# EAGLE design RoboSkinRev1 (EAGLE 9.4.2)
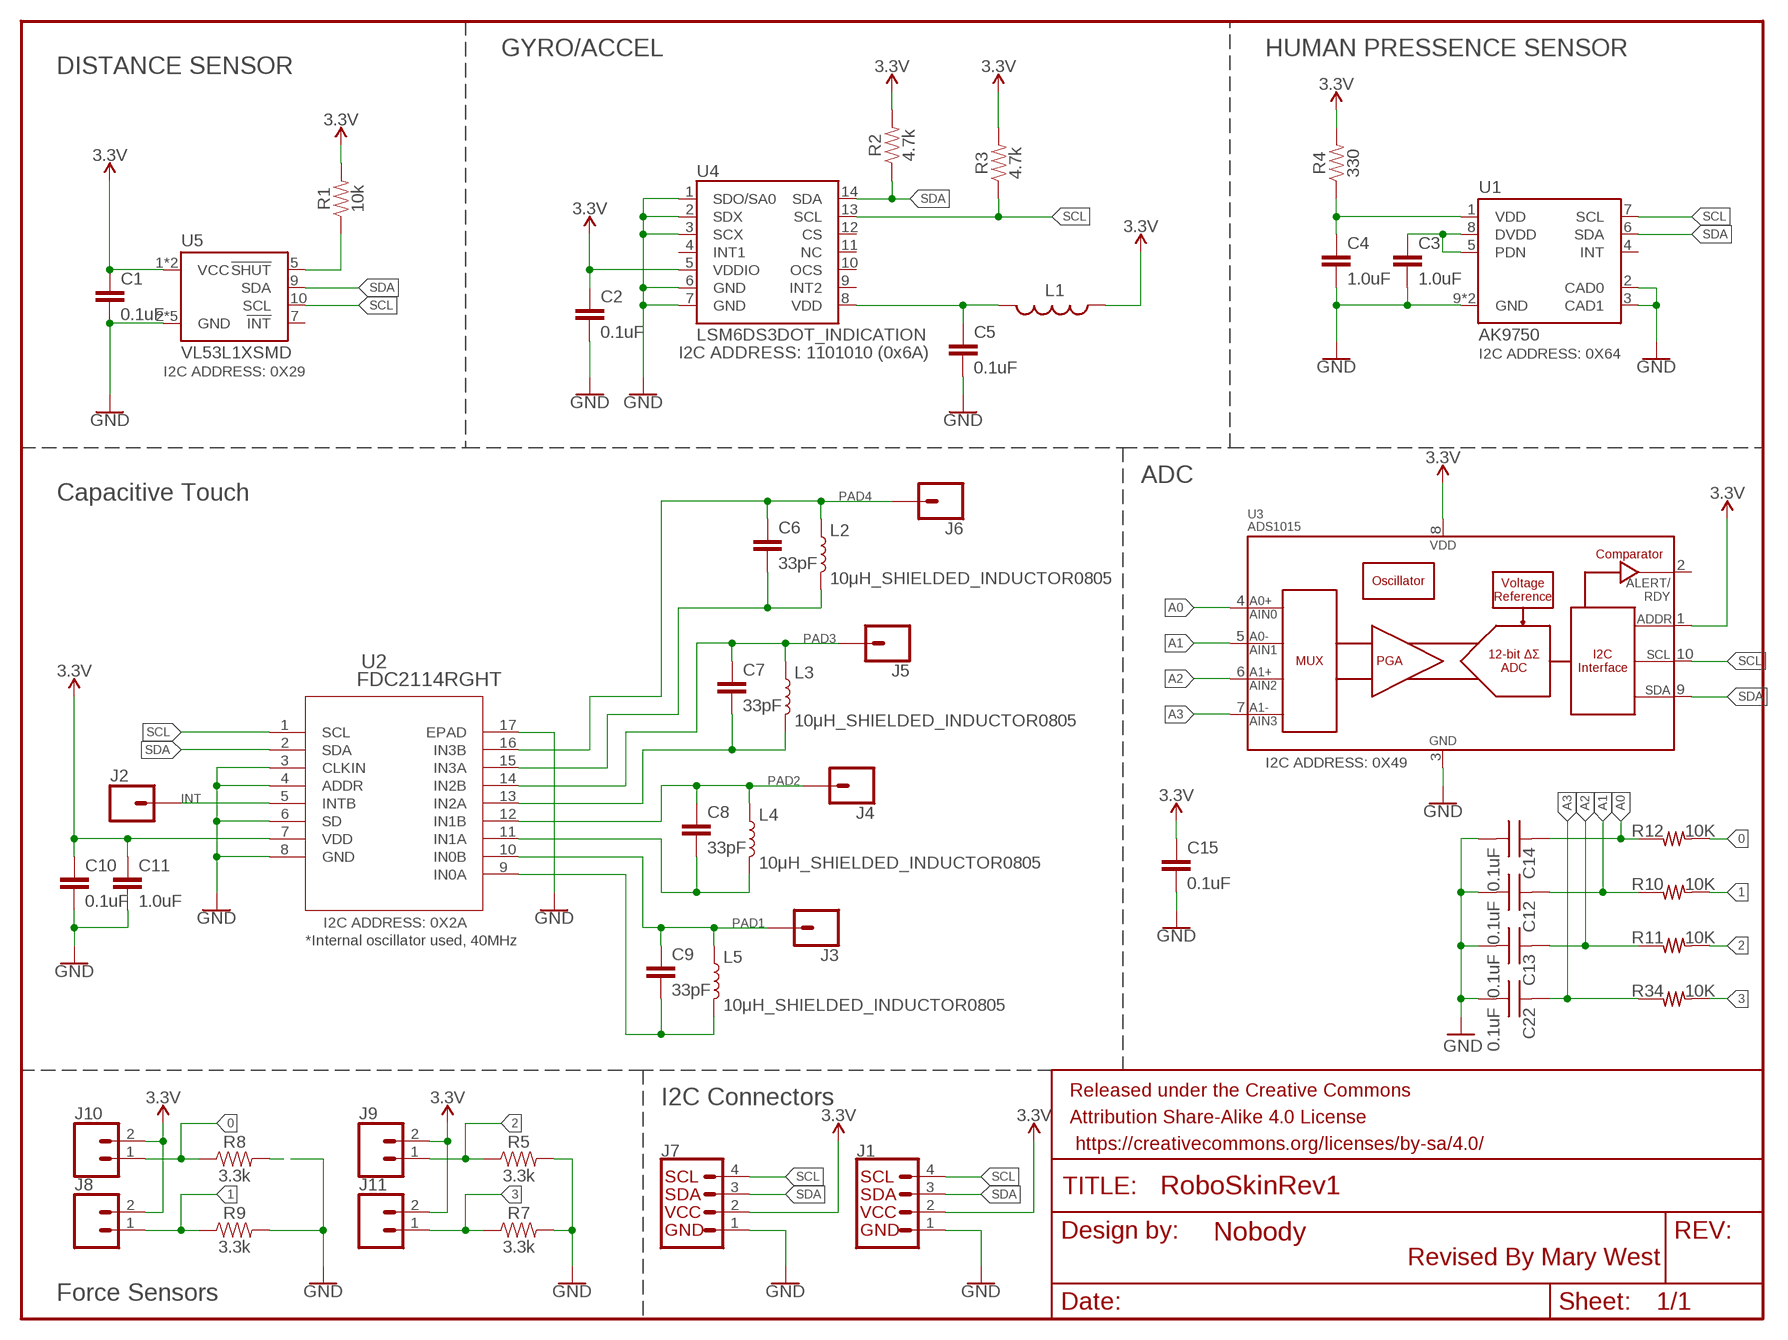
[diagram p0: schematic, sheet 1]

## Parts
C1  0.1uF  0.1UF-0603-25V-(+80/-20%)  [0603]
C2  0.1uF  0.1UF-0603-25V-(+80/-20%)  [0603]
C3  1.0uF  1.0UF-0603-16V-10%  [0603]
C4  1.0uF  1.0UF-0603-16V-10%  [0603]
C5  0.1uF  0.1UF-0603-25V-(+80/-20%)  [0603]
C6  33pF  33PF-0603-50V-5%  [0603]
C7  33pF  33PF-0603-50V-5%  [0603]
C8  33pF  33PF-0603-50V-5%  [0603]
C9  33pF  33PF-0603-50V-5%  [0603]
C10  0.1uF  0.1UF-0603-25V-(+80/-20%)  [0603]
C11  1.0uF  1.0UF-0603-16V-10%  [0603]
C12  0.1uF  CAPACITORC_0603_SILK  [0603_SILK]
C13  0.1uF  CAPACITORC_0603_SILK  [0603_SILK]
C14  0.1uF  CAPACITORC_0603_SILK  [0603_SILK]
C15  0.1uF  0.1UF-0603-25V-(+80/-20%)  [0603]
C22  0.1uF  CAPACITORC_0603_SILK  [0603_SILK]
FRAME1  FRAME-LETTERNO_PACKAGE  [DUMMY]
J1  QWIIC_CONNECTORJS-1MM  [1X04_1MM_RA]
J2  CONN_01  [1X01]
J3  CONN_01  [1X01]
J4  CONN_01  [1X01]
J5  CONN_01  [1X01]
J6  CONN_01  [1X01]
J7  QWIIC_CONNECTORJS-1MM  [1X04_1MM_RA]
J8  CONN_02  [1X02]
J9  CONN_02  [1X02]
J10  CONN_02  [1X02]
J11  CONN_02  [1X02]
L1  RES-07859  INDUCTOR30OHM,1.8A  [0603]
L2  10μH_SHIELDED_INDUCTOR0805  [0805]
L3  10μH_SHIELDED_INDUCTOR0805  [0805]
L4  10μH_SHIELDED_INDUCTOR0805  [0805]
L5  10μH_SHIELDED_INDUCTOR0805  [0805]
R1  10k  10KOHM-0603-1/10W-1%  [0603]
R2  4.7k  4.7KOHM-0603-1/10W-1%  [0603]
R3  4.7k  4.7KOHM-0603-1/10W-1%  [0603]
R4  330  330OHM-0603-1/10W-1%  [0603]
R5  3.3k  3.3KOHM-0603-1/10W-1%  [0603]
R7  3.3k  3.3KOHM-0603-1/10W-1%  [0603]
R8  3.3k  3.3KOHM-0603-1/10W-1%  [0603]
R9  3.3k  3.3KOHM-0603-1/10W-1%  [0603]
R10  10K  RESISTORR_0603_SILK  [0603_SILK]
R11  10K  RESISTORR_0603_SILK  [0603_SILK]
R12  10K  RESISTORR_0603_SILK  [0603_SILK]
R34  10K  RESISTORR_0603_SILK  [0603_SILK]
U1  AK9750  [SON10]
U2  FDC2114RGHT  [RGH16]
U3  ADS1015  [MSOP10]
U4  LSM6DS3DOT_INDICATION  [LGA14L_DOT_INDICATOR]
U5  VL53L1XSMD  [VL53L1X]

## Nets
0: J10.1 R8.1 R12.P2
1: J8.1 R9.1 R10.P2
2: J9.1 R5.1 R11.P2
3: J11.1 R7.1 R34.P2
3.3V: C1.1 C2.1 C10.1 C11.1 C15.1 J1.2(VCC) J7.2(VCC) J8.2 J9.2 J10.2 J11.2 L1.1 R1.2 R2.2 R3.2 R4.2 U2.7(VDD) U3.1(ADDR) U3.8(VDD) U4.5(VDDIO) U5.1(VCC) U5.11(VCC)
A0: C14.P1 R12.P1 U3.4(AIN0)
A1: C12.P1 R10.P1 U3.5(AIN1)
A2: C13.P1 R11.P1 U3.6(AIN2)
A3: C22.P1 R34.P1 U3.7(AIN3)
GND: C1.2 C2.2 C3.2 C4.2 C5.2 C10.2 C11.2 C12.P2 C13.P2 C14.P2 C15.2 C22.P2 J1.1(GND) J7.1(GND) R5.2 R7.2 R8.2 R9.2 U1.2(CAD0) U1.3(CAD1) U1.9(GND) U1.10(GND) U2.3(CLKIN) U2.4(ADDR) U2.6(SD) U2.8(GND) U2.17(EPAD) U3.3(VSS) U4.1(SDO/SA0) U4.2(SDX) U4.3(SCX) U4.6(GND) U4.7(GND) U5.2(GND) U5.3(GND) U5.4(GND) U5.6(GND) U5.12(GND)
INT: J2.1 U2.5(INTB)
N$1: C4.1 R4.1 U1.1(VDD)
N$2: C3.1 U1.5(PDN) U1.8(DVDD)
N$3: R1.1 U5.5(!SHUT)
N$6: C5.1 L1.2 U4.8(VDD)
N$8: C6.2 L2.2 U2.15(IN3A)
N$10: C7.2 L3.2 U2.13(IN2A)
N$12: C8.2 L4.2 U2.11(IN1A)
N$14: C9.2 L5.2 U2.9(IN0A)
PAD1: C9.1 J3.1 L5.1 U2.10(IN0B)
PAD2: C8.1 J4.1 L4.1 U2.12(IN1B)
PAD3: C7.1 J5.1 L3.1 U2.14(IN2B)
PAD4: C6.1 J6.1 L2.1 U2.16(IN3B)
SCL: J1.4(SCL) J7.4(SCL) R3.1 U1.7(SCL) U2.1(SCL) U3.10(SCL) U4.13(SCL) U5.10(SCL)
SDA: J1.3(SDA) J7.3(SDA) R2.1 U1.6(SDA) U2.2(SDA) U3.9(SDA) U4.14(SDA) U5.9(SDA)
Unconnected: U1.4(INT) U3.2(ALERT/RDY) U4.4(INT1) U4.9(INT2) U4.10(OCS) U4.11(NC) U4.12(CS) U5.7(!INT)

## Notes on the sheet
- GYRO/ACCEL | HUMAN PRESSENCE SENSOR
- DISTANCE SENSOR
- I2C ADDRESS: 1101010 (0x6A) | I2C ADDRESS: 0X64
- I2C ADDRESS: 0X29
- ADC
- Capacitive Touch
- I2C ADDRESS: 0X49
- I2C ADDRESS: 0X2A
- *Internal oscillator used, 40MHz
- I2C Connectors
- Revised By Mary West
- Force Sensors

## Library data of the parts
C1 C2 C5 C10 C15 = SparkFun-Capacitors:0.1UF: 0.1µF ceramic capacitors A capacitor is a passive two-terminal electrical component used to store electrical energy temporarily in an electric field.; PROD_ID: CAP-00810
C3 C4 C11 = SparkFun-Capacitors:1.0UF: 1µF ceramic capacitors A capacitor is a passive two-terminal electrical component used to store electrical energy temporarily in an electric field.; PROD_ID: CAP-00868
C6-C9 = SparkFun-Capacitors:33PF: 33pF ceramic capacitors A capacitor is a passive two-terminal electrical component used to store electrical energy temporarily in an electric field.; PROD_ID: CAP-10142
C12-C14 C22 = 1_BES_Passives:CAPACITOR: SMT Capacitor; PARTNO: GRM188R70J104KA01D
FRAME1 = SparkFun-Aesthetics:FRAME-LETTER: Schematic Frame - Letter Standard 8.5x11 US Letter frame; DESIGNER: Nobody; VERSION: v01
J1 J7 = SparkFun-Connectors:QWIIC_CONNECTOR: SparkFun I2C Standard Qwiic Connector An SMD 1mm pitch JST connector makes it easy and quick (get it? Qwiic?) to connect I2C devices to each other. The Qwiic system <http://www.sparkfun.com/qwiic> enables fast and solderless connection between popular platforms and various sensors and actuators. We carry 200mm <https://www.sparkfun.com/products/14204>, 100mm <https://www.sparkfun.com/products/14205>, 50mm <https://www.sparkfun.com/products/14206>, and breadboard friendly <https://www.sparkfun.com/products/14207> Qwiic cables. We also offer 10 pcs strips <https://www.sparkfun.com/products/14323> the SMD connectors.
J2-J6 = SparkFun-Connectors:CONN_01: Single connection point. Often used as Generic Header-pin footprint for 0.1 inch spaced/style header connections On any of the 0.1 inch spaced packages, you can populate with these: Break Away Headers - Straight <https://www.sparkfun.com/products/116> (PRT-00116) Break Away Male Headers - Right Angle <https://www.sparkfun.com/products/553> (PRT-00553) Female Headers <https://www.sparkfun.com/products/115> (PRT-00115) Break Away Headers - Machine Pin <https://www.sparkfun.com/products/117> (PRT-00117) Break Away Female Headers - Swiss Machine Pin <https://www.sparkfun.com/products/743> (PRT-00743) This device is also useful as a general connection point to wire up your design to another part of your project. Our various solder wires solder well into these plated through hole pads. Hook-Up Wire - Assortment (Stranded, 22 AWG) <https://www.sparkfun.com/products/11375> (PRT-11375) Hook-Up Wire - Assortment (Solid Core, 22 AWG) <https://www.sparkfun.com/products/11367> (PRT-11367) View the entire wire category on our website here <https://www.sparkfun.com/categories/141> Special notes: SMTSO-256-ET is a "flush mount" nut for a 4-40 screw. We mostly use this on specialty testbeds; it is a nice way to connect hardware to your PCB at an adjustable hieght. Also note, the SNAP packages are for using a snappable style connector. We sell a baggie of snaps and they are also used on two LilyPad designs: Snap Assortment - 30 pack (male and female) <https://www.sparkfun.com/products/11347> (DEV-11347) LilyPad Arduino SimpleSnap <https://www.sparkfun.com/products/10941> (DEV-10941) LilyPad SimpleSnap Protoboard <https://www.sparkfun.com/products/10940> (DEV-10940)
J8-J11 = SparkFun-Connectors:CONN_02: Multi connection point. Often used as Generic Header-pin footprint for 0.1 inch spaced/style header connections On any of the 0.1 inch spaced packages, you can populate with these: Break Away Headers - Straight <https://www.sparkfun.com/products/116> (PRT-00116) Break Away Male Headers - Right Angle <https://www.sparkfun.com/products/553> (PRT-00553) Female Headers <https://www.sparkfun.com/products/115> (PRT-00115) Break Away Headers - Machine Pin <https://www.sparkfun.com/products/117> (PRT-00117) Break Away Female Headers - Swiss Machine Pin <https://www.sparkfun.com/products/743> (PRT-00743) For SCREWTERMINALS and SPRING TERMINALS visit here: Screw Terimnals on SparkFun.com <https://www.sparkfun.com/search/results?term=Screw+Terminals> (5mm/3.5mm/2.54mm spacing) This device is also useful as a general connection point to wire up your design to another part of your project. Our various solder wires solder well into these plated through hole pads. Hook-Up Wire - Assortment (Stranded, 22 AWG) <https://www.sparkfun.com/products/11375> (PRT-11375) Hook-Up Wire - Assortment (Solid Core, 22 AWG) <https://www.sparkfun.com/products/11367> (PRT-11367) View the entire wire category on our website here <https://www.sparkfun.com/categories/141> Special notes: Molex polarized connector foot print use with: PRT-08233 with associated crimp pins and housings. 2.54_SCREWTERM for use with PRT-10571. 3.5mm Screw Terminal footprints for PRT-08084 5mm Screw Terminal footprints for use with PRT-08432
L1 = SparkFun-Passives:INDUCTOR: Inductors Basic Inductor/Choke - 0603 and 1206. Footprints are not proven and vary greatly between part numbers. SRN6045- 33uH, 20% 1.4A SDR0403-560KL - 56uH, 10%, 500mA RMS/740mA peak; PROD_ID: RES-07859
L2-L5 = SparkFun-Coils:10μH_SHIELDED_INDUCTOR: Murata 10uH Inductor 10uH 60mA 400mOhm 0805 Package Shielded; PROD_ID: NDUC-13231
R1 = SparkFun-Resistors:10KOHM: 10kΩ resistor A resistor is a passive two-terminal electrical component that implements electrical resistance as a circuit element. Resistors act to reduce current flow, and, at the same time, act to lower voltage levels within circuits. - Wikipedia; PROD_ID: RES-00824
R2 R3 = SparkFun-Resistors:4.7KOHM: 4.7kΩ resistor A resistor is a passive two-terminal electrical component that implements electrical resistance as a circuit element. Resistors act to reduce current flow, and, at the same time, act to lower voltage levels within circuits. - Wikipedia; PROD_ID: RES-07857
R4 = SparkFun-Resistors:330OHM: 330Ω resistor A resistor is a passive two-terminal electrical component that implements electrical resistance as a circuit element. Resistors act to reduce current flow, and, at the same time, act to lower voltage levels within circuits. - Wikipedia; PROD_ID: RES-00818
R5 R7-R9 = SparkFun-Resistors:3.3KOHM: 3.3kΩ resistor A resistor is a passive two-terminal electrical component that implements electrical resistance as a circuit element. Resistors act to reduce current flow, and, at the same time, act to lower voltage levels within circuits. - Wikipedia; PROD_ID: RES-07851
R10-R12 R34 = 1_BES_Passives:RESISTOR: Resistor, Chip Mount, SMT; PARTNO: CR0603-FX-1002ELF
U1 = SparkFun-Sensors:AK9750: AK9750/AK9753 Human Movement Sensor; PROD_ID: SEN-13737
U2 = FDC2114:FDC2114RGHT; BUILT_BY: EMA_Jessica; COPYRIGHT: Copyright (C) 2018 Accelerated Designs. All rights reserved; MANUFACTURER_PART_NUMBER: FDC2114RGHT; VENDOR: Texas Instruments
U3 = SparkFun-IC-Conversion:ADS1015: ADS1015 12-BIT ADC 12-Bit Del-Sig ADC Four single-ended inputs or two differential inputs Internal PGA I2C interface 2.0-5.5V SparkFun Products SparkFun Block for Intel Edison - ADC <https://www.sparkfun.com/products/13770> (DEV-13770); PROD_ID: IC-12270
U4 = LSM6DS3:LSM6DS3; PROD_ID: IC-12969
U5 = SparkFun-Sensors:VL53L1X: STMicroelectronics VL53L1X - 400 cm IR Laser ToF Sensor VL53L1X is a state-of-the-art ToF laser-ranging sensor, enhancing the ST FlightSense product family. It is the fastest miniature ToF sensor currently on the market with accurate ranging up to 4 m and fast ranging frequency (up to 50 Hz). Housed in a miniature and reflowable package, it integrates a single photon avalanche diode (SPAD) receiving array, a 940 nm invisible laser Class 1 emitter, physical infrared filters, and optics to achieve the best ranging performance in various ambient lighting conditions with a range of cover window options.; PROD_ID: IC-13960

## Board
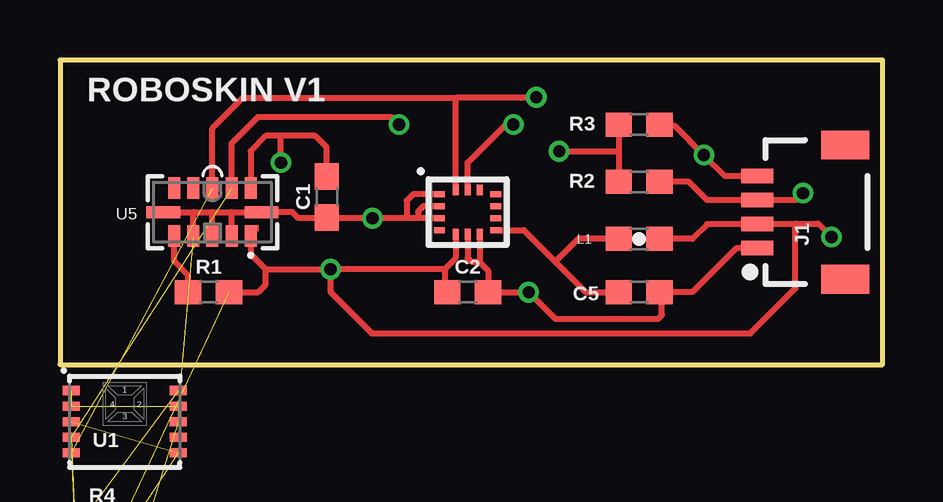
[diagram p1: board, top side]
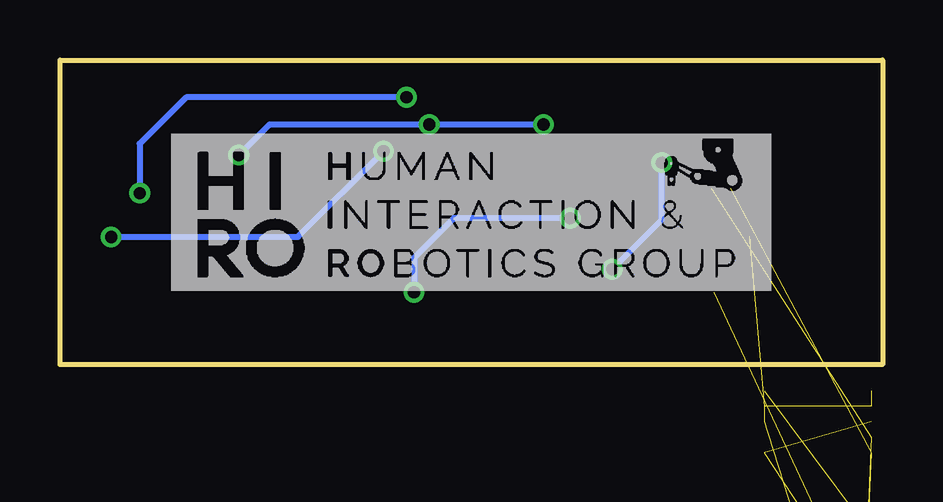
[diagram p2: board, bottom side, seen from below]

Size 34.28 x 12.69 mm. Coordinates in mm from the lower left corner, seen from the top.
Outline: 0,0 34.28,0 34.28,12.69 0,12.69 0,0
Copper layers (1*16): Top 0.035mm / dielectric 1.5mm / Bottom 0.035mm
Design rules "SparkFun-2-layer-TIGHT": minimum track width 7mil, minimum drill 15mil, track to track 7mil, track to pad 7mil, pad to pad 7mil, via to via 7mil, smd to smd 7mil, copper to edge 7mil, drill to drill 7mil, minimum pad ring 7mil, minimum via ring 7mil, stop-mask expansion 4mil, vias tented up to drill 25mil, thermal gap 10mil

### Footprints (pad centres in the part's own frame; a part is rotated, then mirrored left to right if it is on the bottom)
0603 = smd 1.1 x 1: 1 -0.85,0; 2 0.85,0
0603_SILK = smd 0.8 x 1: P1 -0.7,0; P2 0.7,0
1X04_1MM_RA = smd 0.6 x 1.35: 1 -1.5,0; 2 -0.5,0; 3 0.5,0; 4 1.5,0 | smd 1.2 x 2: NC1 2.8,-3.675; NC2 -2.8,-3.675
1X01 = drill 1.016 pad 1.88: 1 0,0
1X02 = drill 1.016 pad 1.88: 1 0,0; 2 2.54,0
0805 = smd 0.8 x 1.2: 1 -0.9,0; 2 0.9,0
SON10 = smd 0.7 x 0.38: 1 2.225,1.3; 2 2.225,0.65; 3 2.225,0; 4 2.225,-0.65; 5 2.225,-1.3; 6 -2.225,-1.3; 7 -2.225,-0.65; 8 -2.225,0; 9 -2.225,0.65; 10 -2.225,1.3
RGH16 = smd 0.6 x 0.25: 1 -1.9,0.75; 2 -1.9,0.25; 3 -1.9,-0.25; 4 -1.9,-0.75; 9 1.9,-0.75; 10 1.9,-0.25; 11 1.9,0.25; 12 1.9,0.75 | smd 0.25 x 0.6: 5 -0.75,-1.9; 6 -0.25,-1.9; 7 0.25,-1.9; 8 0.75,-1.9; 13 0.75,1.9; 14 0.25,1.9; 15 -0.25,1.9; 16 -0.75,1.9 | smd 2.6 x 2.6: 17 0,0
MSOP10 = smd 0.3 x 1: 1 -1,-2.05; 2 -0.5,-2.05; 3 0,-2.05; 4 0.5,-2.05; 5 1,-2.05; 6 1,2.05; 7 0.5,2.05; 8 0,2.05; 9 -0.5,2.05; 10 -1,2.05
LGA14L_DOT_INDICATOR = smd 0.45 x 0.25: 1 -1.175,0.75; 2 -1.175,0.25; 3 -1.175,-0.25; 4 -1.175,-0.75; 8 1.175,-0.75; 9 1.175,-0.25; 10 1.175,0.25; 11 1.175,0.75 | smd 0.25 x 0.45: 5 -0.5,-0.925; 6 0,-0.925; 7 0.5,-0.925; 12 0.5,0.925; 13 0,0.925; 14 -0.5,0.925
VL53L1X = smd 0.5 x 0.9: 1 1.6,-1; 2 0.8,-1; 3 0,-1; 4 -0.8,-1; 5 -1.6,-1; 7 -1.6,1; 8 -0.8,1; 9 0,1; 10 0.8,1; 11 1.6,1 | smd 1.4 x 0.5: 6 -2.05,0; 12 2.05,0

### Placement (x,y rotation side)
C1  11.11,6.99 270 top
C2  16.99,3.02 0 top
C3  1.75,-9.84 0 top  (outside the outline)
C4  1.75,-13.18 0 top  (outside the outline)
C5  24.13,3.02 0 top
C6  -3.17,-22.7 0 top  (outside the outline)
C7  -3.17,-26.04 0 top  (outside the outline)
C8  -3.17,-29.37 0 top  (outside the outline)
C9  -3.17,-32.7 0 top  (outside the outline)
C10  -38.89,-56.52 0 top  (outside the outline)
C11  -38.89,-59.85 0 top  (outside the outline)
C12  -39.21,-84.45 0 top  (outside the outline)
C13  -39.21,-87.31 0 top  (outside the outline)
C14  -39.21,-90.17 0 top  (outside the outline)
C15  -38.89,-117.63 0 top  (outside the outline)
C22  -39.21,-93.03 0 top  (outside the outline)
FRAME1  0,-14.76 0 top  (outside the outline)
J1  29.05,6.35 90 top
J2  -3.17,-18.57 0 top  (outside the outline)
J3  -26.99,-46.51 0 top  (outside the outline)
J4  -30.96,-46.51 0 top  (outside the outline)
J5  -34.92,-46.51 0 top  (outside the outline)
J6  -38.89,-46.51 0 top  (outside the outline)
J7  -37.15,-50.01 0 top  (outside the outline)
J8  -38.89,-103.03 0 top  (outside the outline)
J9  -38.89,-106.84 0 top  (outside the outline)
J10  -38.89,-110.65 0 top  (outside the outline)
J11  -38.89,-114.46 0 top  (outside the outline)
L1  24.13,5.24 180 top
L2  -3.17,-36.2 0 top  (outside the outline)
L3  -8.1,-39.85 0 top  (outside the outline)
L4  -13.02,-43.5 0 top  (outside the outline)
L5  -17.94,-47.15 0 top  (outside the outline)
R1  6.19,3.02 0 top
R2  24.13,7.62 180 top
R3  24.13,10 180 top
R4  1.75,-6.51 0 top  (outside the outline)
R5  -38.89,-63.18 0 top  (outside the outline)
R7  -38.89,-69.85 0 top  (outside the outline)
R8  -38.89,-73.18 0 top  (outside the outline)
R9  -38.89,-76.52 0 top  (outside the outline)
R10  -39.21,-95.89 0 top  (outside the outline)
R11  -33.5,-95.89 0 top  (outside the outline)
R12  -39.21,-98.74 0 top  (outside the outline)
R34  -33.5,-98.74 0 top  (outside the outline)
U1  2.7,-2.38 0 top
U2  3.02,-18.41 0 top  (outside the outline)
U3  -37.78,-80.8 0 top  (outside the outline)
U4  16.99,6.35 0 top
U5  6.35,6.35 0 top
U$1  [CAPTURE#PNG]  17.14,6.35 0 bottom

### Tracks (layer width: path | path; a pad name or v marks a point on that pad's centre or on a via)
0  (2 unrouted)
1  (2 unrouted)
2  (2 unrouted)
3  (2 unrouted)
3.3V  (via drill 0.51)  (12 unrouted)
  Top 0.254: U4.5 16.49,4.42 16.03,3.97 | 16.03,3.97 16.03,3.28 16.14,3.17 C2.1 | L1.1 26.35,5.24 26.96,5.85 J1.2 29.07,5.87 30.64,5.87 | U5.1 7.95,4.62 7.94,4.6 8.57,3.97 | 8.57,3.97 v11.27,3.97 | 16.03,3.97 v11.27,3.97 | R1.2 8.26,3.02 8.57,3.33 8.57,3.97 | R3.2 23.28,8.89 | 23.28,8.89 R2.2 | v32.15,5.32 31.59,5.87 30.64,5.87 | 30.64,5.87 30.64,3.17 28.77,1.3 12.99,1.3 11.27,3.02 v11.27,3.97 | C1.1 11.11,9.05 10.64,9.53 9.21,9.53 | 9.21,9.53 8.57,9.53 7.94,8.89 7.94,7.36 U5.11 | v20.8,8.89 23.28,8.89 | v9.21,8.41 9.21,9.53
  Bottom 0.254: v32.15,5.32 24.37,5.32 v20.8,8.89 | v11.27,3.97 9.21,6.03 v9.21,8.41
A0  (2 unrouted)
A1  (2 unrouted)
A2  (2 unrouted)
A3  (2 unrouted)
GND  (via drill 0.51)  (24 unrouted)
  Top 0.254: U4.7 17.49,4.29 | 17.49,4.29 17.49,4.26 17.84,3.91 C2.2 v19.53,3.02 20.64,1.91 24.92,1.91 25.08,2.06 25.08,3.02 | U4.6 16.99,4.45 17.14,4.29 17.49,4.29 | U4.3 14.92,6.1 | 14.92,6.1 14.45,6.1 | 11.08,6.1 v13.02,6.1 14.45,6.1 | U4.2 15.15,6.6 15.14,6.6 14.92,6.38 14.92,6.1 | U4.1 14.72,7.1 14.45,6.83 14.45,6.1 | U5.6 5.56,6.35 | 5.56,6.35 6.35,6.35 | 6.35,6.35 7.14,6.35 | 7.14,6.35 U5.12 9.68,6.35 9.93,6.1 11.08,6.1 | U5.4 5.56,6.35 | U5.3 6.35,6.35 | U5.2 7.15,6.34 7.14,6.35 | J1.1 28.19,4.85 26.35,3.02 25.08,3.02 | 25.08,3.02 C5.2 | C1.2 11.08,6.1
  Bottom 0.254: v13.02,6.1 17.87,6.1 19.53,4.45 v19.53,3.02
INT  (1 unrouted)
N$1  (2 unrouted)
N$2  (2 unrouted)
N$3
  Top 0.254: R1.1 5.34,3.71 4.75,4.3 U5.5
N$6
  Top 0.254: U4.8 19.32,5.6 20.64,4.29 | 20.64,4.29 21.91,3.02 C5.1 | 20.64,4.29 21.59,5.24 L1.2
N$8  (2 unrouted)
N$10  (2 unrouted)
N$12  (2 unrouted)
N$14  (2 unrouted)
PAD1  (3 unrouted)
PAD2  (3 unrouted)
PAD3  (3 unrouted)
PAD4  (3 unrouted)
SCL  (via drill 0.51)  (4 unrouted)
  Top 0.254: R3.1 24.98,9.95 25.61,9.95 v26.83,8.73 27.71,7.85 J1.4 | U5.10 7.15,9.21 8.26,10.32 13.81,10.32 v14.13,10 | U4.13 16.99,8.41 18.57,10 v18.89,10
  Bottom 0.254: v14.13,10 v18.89,10 25.56,10 v26.83,8.73
SDA  (via drill 0.51)  (4 unrouted)
  Top 0.254: R2.1 26.19,7.62 26.96,6.85 J1.3 30.66,6.85 v30.96,7.14 | U5.9 6.35,9.84 7.62,11.11 16.51,11.11 | U4.14 16.49,11.09 16.51,11.11 | 16.51,11.11 19.21,11.11 19.23,11.14 v19.84,11.14
  Bottom 0.254: v19.84,11.14 29.03,11.14 30.96,9.21 v30.96,7.14

### Text on the board
tPlace: ROBOSKIN V1
Measures: LSM6DS3